# Altium schematic sheet 1_MCU.SchDoc: Title
size 420 x 297 mm; Address1: Address1; Address2: Address2; Address3: Address3; Address4: Address4; SheetNumber: 1; Scale: 1:1; Title2str: Title2str; DocumentType: Схема электрическая принципиальная
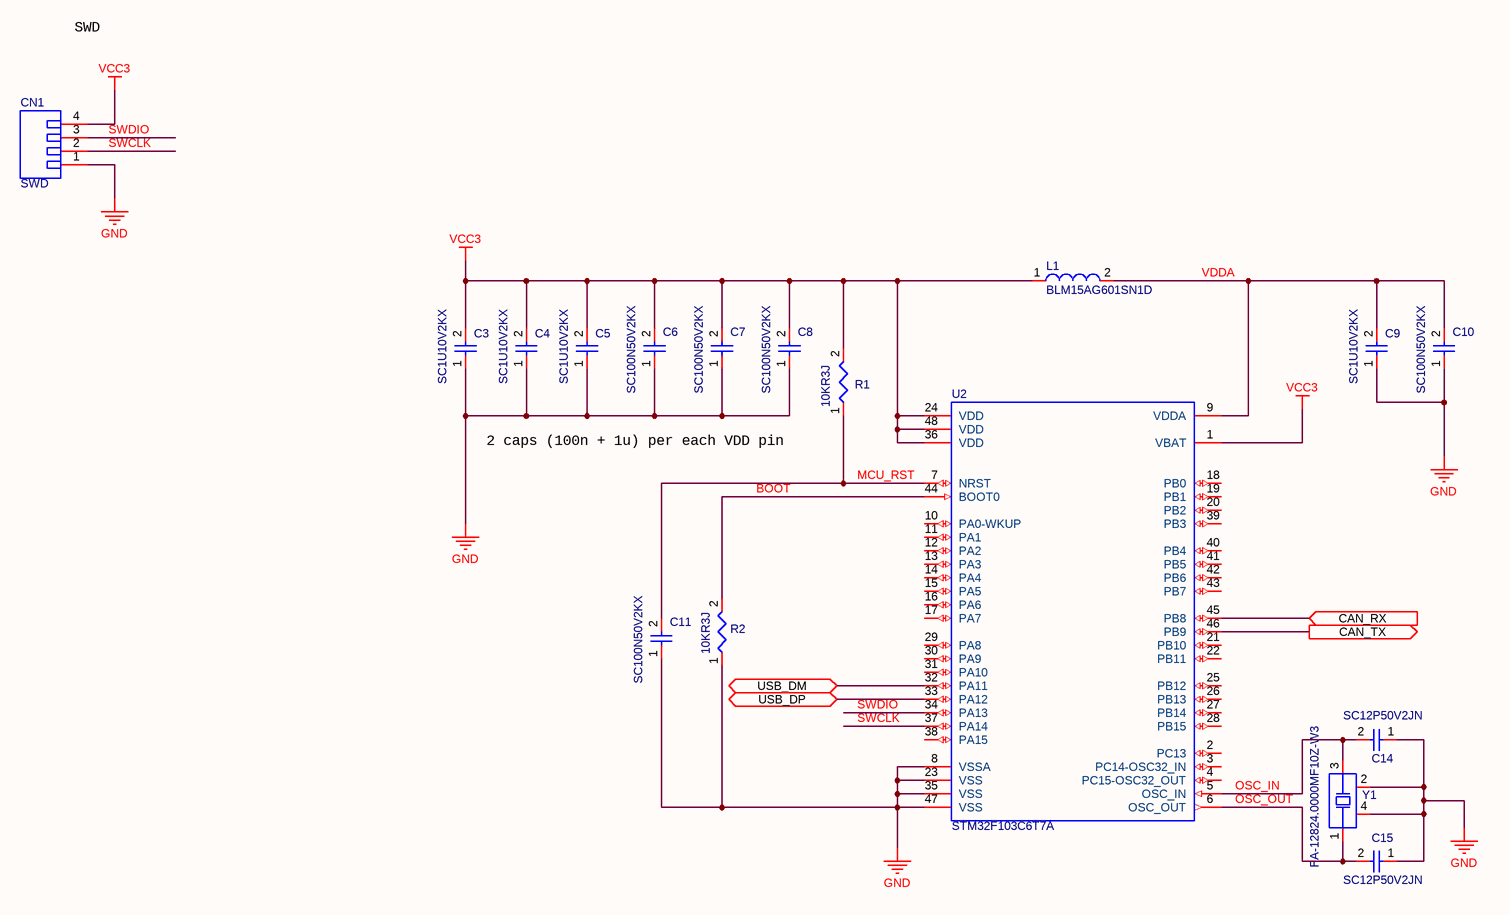
[diagram p0: 1_MCU.SchDoc]

## Parts
C3  SC1U10V2KX  [CAPC0402(1005)60_L]
C4  SC1U10V2KX  [CAPC0402(1005)60_L]
C5  SC1U10V2KX  [CAPC0402(1005)60_L]
C6  SC100N50V2KX  [CAPC0402(1005)60_L]
C7  SC100N50V2KX  [CAPC0402(1005)60_L]
C8  SC100N50V2KX  [CAPC0402(1005)60_L]
C9  SC1U10V2KX  [CAPC0402(1005)60_L]
C10  SC100N50V2KX  [CAPC0402(1005)60_L]
C11  SC100N50V2KX  [CAPC0402(1005)60_L]
C14  SC12P50V2JN  [CAPC0402(1005)33_L]
C15  SC12P50V2JN  [CAPC0402(1005)33_L]
CN1  SWD  [4PHEADERS-2D54]
L1  BLM15AG601SN1D  [INDC1005X06L]
R1  10KR3J  [RESC0603(1608)_L]
R2  10KR3J  [RESC0603(1608)_L]
U2  STM32F103C6T7A  [TSQFP50P900X900X160-48L]
Y1  FA-12824.0000MF10Z-W3  [QRTZ-12mhz]

## Ports
CAN_RX (in), CAN_TX (out), USB_DM (bidir), USB_DP (bidir)

## Nets
GND: C3.1 C4.1 C5.1 C6.1 C7.1 C8.1 C9.1 C10.1 C11.1 C14.1 C15.1 CN1.1 R2.1 U2.8(VSSA) U2.23(VSS) U2.35(VSS) U2.47(VSS) Y1.2(NC) Y1.4(NC)
VCC3: C3.2 C4.2 C5.2 C6.2 C7.2 C8.2 CN1.4 L1.1 R1.2 U2.1(VBAT) U2.24(VDD) U2.36(VDD) U2.48(VDD)
BOOT: R2.2 U2.44(BOOT0)
CAN_RX: U2.45(PB8) ; port CAN_RX
CAN_TX: U2.46(PB9) ; port CAN_TX
MCU_RST: C11.2 R1.1 U2.7(NRST)
OSC_IN: C14.2 U2.5(OSC_IN) Y1.3(X2)
OSC_OUT: C15.2 U2.6(OSC_OUT) Y1.1(X1)
SWCLK: CN1.2 U2.37(PA14)
SWDIO: CN1.3 U2.34(PA13)
USB_DM: U2.32(PA11) ; port USB_DM
USB_DP: U2.33(PA12) ; port USB_DP
VDDA: C9.2 C10.2 L1.2 U2.9(VDDA)

Not connected (* = marked no-connect by the designer): U2 2(PC13) 3(PC14-OSC32_IN) 4(PC15-OSC32_OUT) 10(PA0-WKUP) 11(PA1) 12(PA2) 13(PA3) 14(PA4) 15(PA5) 16(PA6) 17(PA7) 18(PB0) 19(PB1) 20(PB2) 21(PB10) 22(PB11) 25(PB12) 26(PB13) 27(PB14) 28(PB15) 29(PA8) 30(PA9) 31(PA10) 38(PA15) 39(PB3) 40(PB4) 41(PB5) 42(PB6) 43(PB7)

## Notes on the sheet
- SWD
- 2 caps (100n + 1u) per each VDD pin
- Перв. примен.
- Справ. №
- Подп. и дата
- Инв. № дубл.
- Взам. инв. №
- Разраб.
- Изм.
- Лист
- № докум.
- Подп.
- Дата
- Лит.
- Масса
- Масштаб
- Пров.
- Т.контр.
- Листов
- Инв. № подл.
- Утв.
- Н.контр.
- 2.106-A3
- Копировал
- Формат А3

## Library data of the parts
C3-C5 C9 = CAP(0402)1UF10V: CAP 1uF 10V ±10% 0402 (1005 Metric) Thickness 0.6mm SMD
C6-C8 C10 C11 = CAP(0402)100nF50V: CAP 100nF 50V ±10% 0402 (1005 Metric) Thickness 0.6mm SMD
C14 C15 = CAP12pF: CAP 12pF 50V ±5% 0402 (1005 Metric) Thickness 0.33mm SMD
CN1 = 4PIN-CN: 4 holes for 18awg wire; Manufacturer: JST; Datasheet URL: http://www.jst-mfg.com/product/pdf/eng/eGH.pdf; Package Reference: JST-BM04B-GHS-TBT
L1 = IND-filt: Chip Ferrite Bead Single Type 600 Ohms 300mA
R1 R2 = RES0(0603)_10K: 10K 0.1W 5% 0603 (1608 Metric)  SMD
U2 = STM32F103C6T7A: ARM® Cortex®-M3 STM32F1 Microcontroller IC 32-Bit 72MHz 32KB 48-LFQP (7x7); Supply Voltage(Vcc) min (V): 2; FLASH Size (Prog) (kB): 512; Operating Frequency(F) (Processor speed) (MHz): 80; Internal RAM Size (kB): 160; Packing: Tape and Reel; Core: ARM Cortex-M4; I/Os: 38; Case/Package: UFQFN-48; RoHS Compliant: Yes; Mounting Technology: Surface Mount; ComponentLink1Description: Manufacturer URL; ComponentLink1URL: http://www.st.com/; Package Reference: UFQFPN48; ComponentLink2Description: Datasheet; ComponentLink2URL: http://www.st.com/st-web-ui/static/active/en/resource/technical/document/datasheet/CD00161566.pdf; Package Description: 48-Pin Ultra Thin Fine Pitch Quad Flat No-Lead, 7 x 7 x 0.6 mm Body, 0.5 mm Pitch, Exposed Pad
Y1 = XTAL-1-3-4: Crystal, 24 MHz, +/- 10 ppm, -20 to 75 degC, 4-Pin SMD, RoHS, Tape and Reel; Frequency Tolerance: 10ppm; Load Capacitance: 12pF; Frequency: 24MHz; ESR (Equivalent Series Resistance): 80R; Length: 0.079inch; Frequency Stability: 10ppm; Width: 0.063inch; Mounting Technology: SMT; Tolerance: 10ppm; RoHS Compliant: Yes; Termination: SMD/SMT; Number of Pins: 4; Package Quantity: 250; Max Operating Temperature: 75°C; Packaging: Tape and Reel; Radiation Hardening: No; Mount: Surface Mount; Lead Free: Lead Free; Case/Package: SMD/SMT; Height: 0.02inch; Min Operating Temperature: -20°C